# Altium schematic sheet 2.2nF 50V SCH.schdoc
size 124 x 101 mm
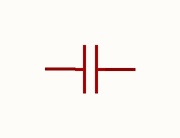
[diagram p0: 2.2nF 50V SCH.schdoc]

## Parts
C?  2.2nF  [C0603]  (value not drawn)

## Nets

Not connected (* = marked no-connect by the designer): C? 1 2

## Library data of the parts
C? = CC0603KRX7R9BB222: Manufacturer: YAGEO(国巨); Add into BOM: yes; Tolerance: ±10%; Symbol: CC0603KRX7R9BB222; Device: CC0603KRX7R9BB222; LCSC Part Name: 2.2nF ±10% 50V; Supplier Part: C107082; Manufacturer Part: CC0603KRX7R9BB222; Supplier Footprint: 0603; JLCPCB Part Class: Extended Part; Datasheet: https://atta.szlcsc.com/upload/public/pdf/source/20180910/C282072_33301C7F631E79921B82A8DAC6BCC5B3.pdf; Supplier: LCSC; Convert to PCB: yes; Value: 2.2nF